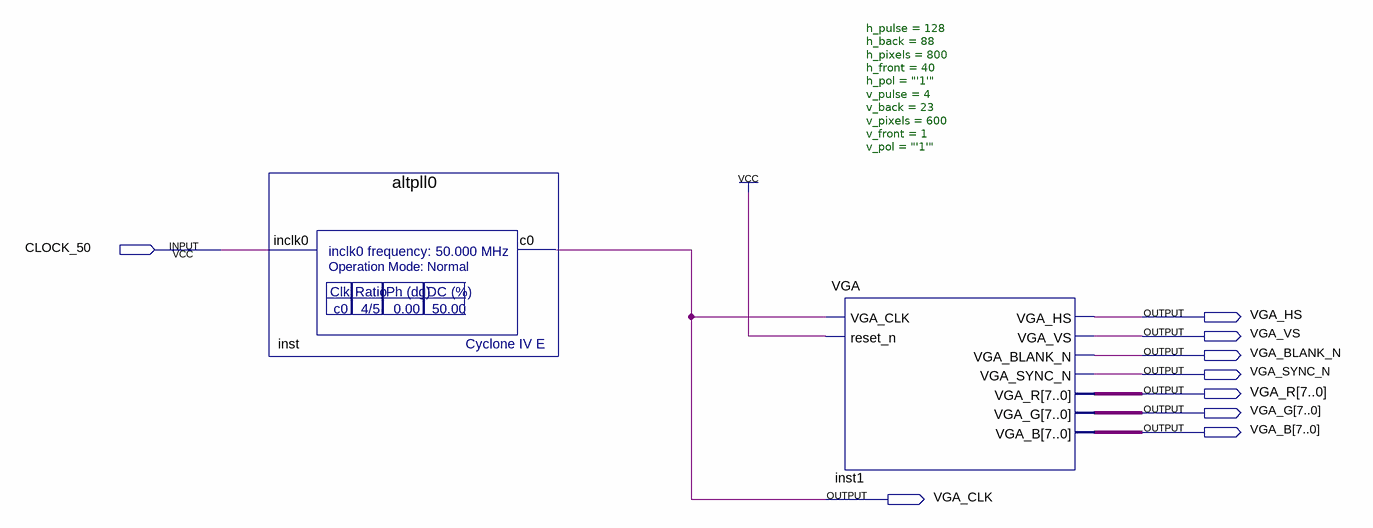
[diagram p0: schematic sheet]
// Quartus schematic VGA_V2.bdf as structural Verilog: 2 symbols, 9 pins
module VGA_V2 (
  input  CLOCK_50,
  output VGA_HS,
  output VGA_VS,
  output VGA_BLANK_N,
  output VGA_SYNC_N,
  output [7:0] VGA_R,
  output [7:0] VGA_G,
  output [7:0] VGA_B,
  output VGA_CLK
);

  altpll0 inst (.inclk0(CLOCK_50), .c0(VGA_CLK));
  VGA #(.h_pulse(128), .h_back(88), .h_pixels(800), .h_front(40), .h_pol("'1'"), .v_pulse(4), .v_back(23), .v_pixels(600), .v_front(1), .v_pol("'1'")) inst1 (
    .VGA_CLK(VGA_CLK), .reset_n(1'b1), .VGA_HS(VGA_HS), .VGA_VS(VGA_VS), .VGA_BLANK_N(VGA_BLANK_N),
    .VGA_SYNC_N(VGA_SYNC_N), .VGA_R(VGA_R), .VGA_G(VGA_G), .VGA_B(VGA_B));
endmodule
